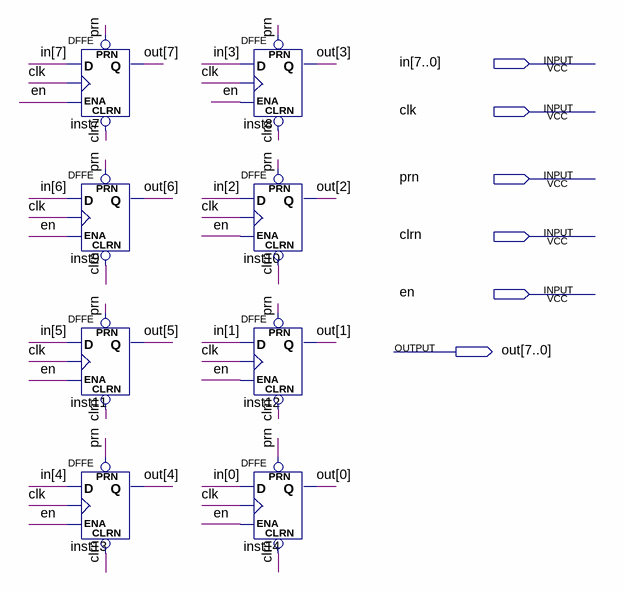
[diagram p0: schematic sheet]
// Quartus schematic Reg_8.bdf as structural Verilog: 8 symbols, 6 pins
module Reg_8 (
  input  [7:0] in,
  input  clk,
  input  prn,
  input  clrn,
  input  en,
  output [7:0] out
);

  DFFE inst7 (.PRN(prn), .CLRN(clrn), .D(in[7]), .CLK(clk), .ENA(en), .Q(out[7]));
  DFFE inst9 (.PRN(prn), .CLRN(clrn), .D(in[6]), .CLK(clk), .ENA(en), .Q(out[6]));
  DFFE inst11 (.PRN(prn), .CLRN(clrn), .D(in[5]), .CLK(clk), .ENA(en), .Q(out[5]));
  DFFE inst13 (.PRN(prn), .CLRN(clrn), .D(in[4]), .CLK(clk), .ENA(en), .Q(out[4]));
  DFFE inst8 (.PRN(prn), .CLRN(clrn), .D(in[3]), .CLK(clk), .ENA(en), .Q(out[3]));
  DFFE inst10 (.PRN(prn), .CLRN(clrn), .D(in[2]), .CLK(clk), .ENA(en), .Q(out[2]));
  DFFE inst12 (.PRN(prn), .CLRN(clrn), .D(in[1]), .CLK(clk), .ENA(en), .Q(out[1]));
  DFFE inst14 (.PRN(prn), .CLRN(clrn), .D(in[0]), .CLK(clk), .ENA(en), .Q(out[0]));
endmodule
